# Altium schematic sheet AFE.SchDoc
size Letter; DocumentNumber: 2; SheetNumber: 2; SheetTotal: 5; Website: www.uwmidsun.com
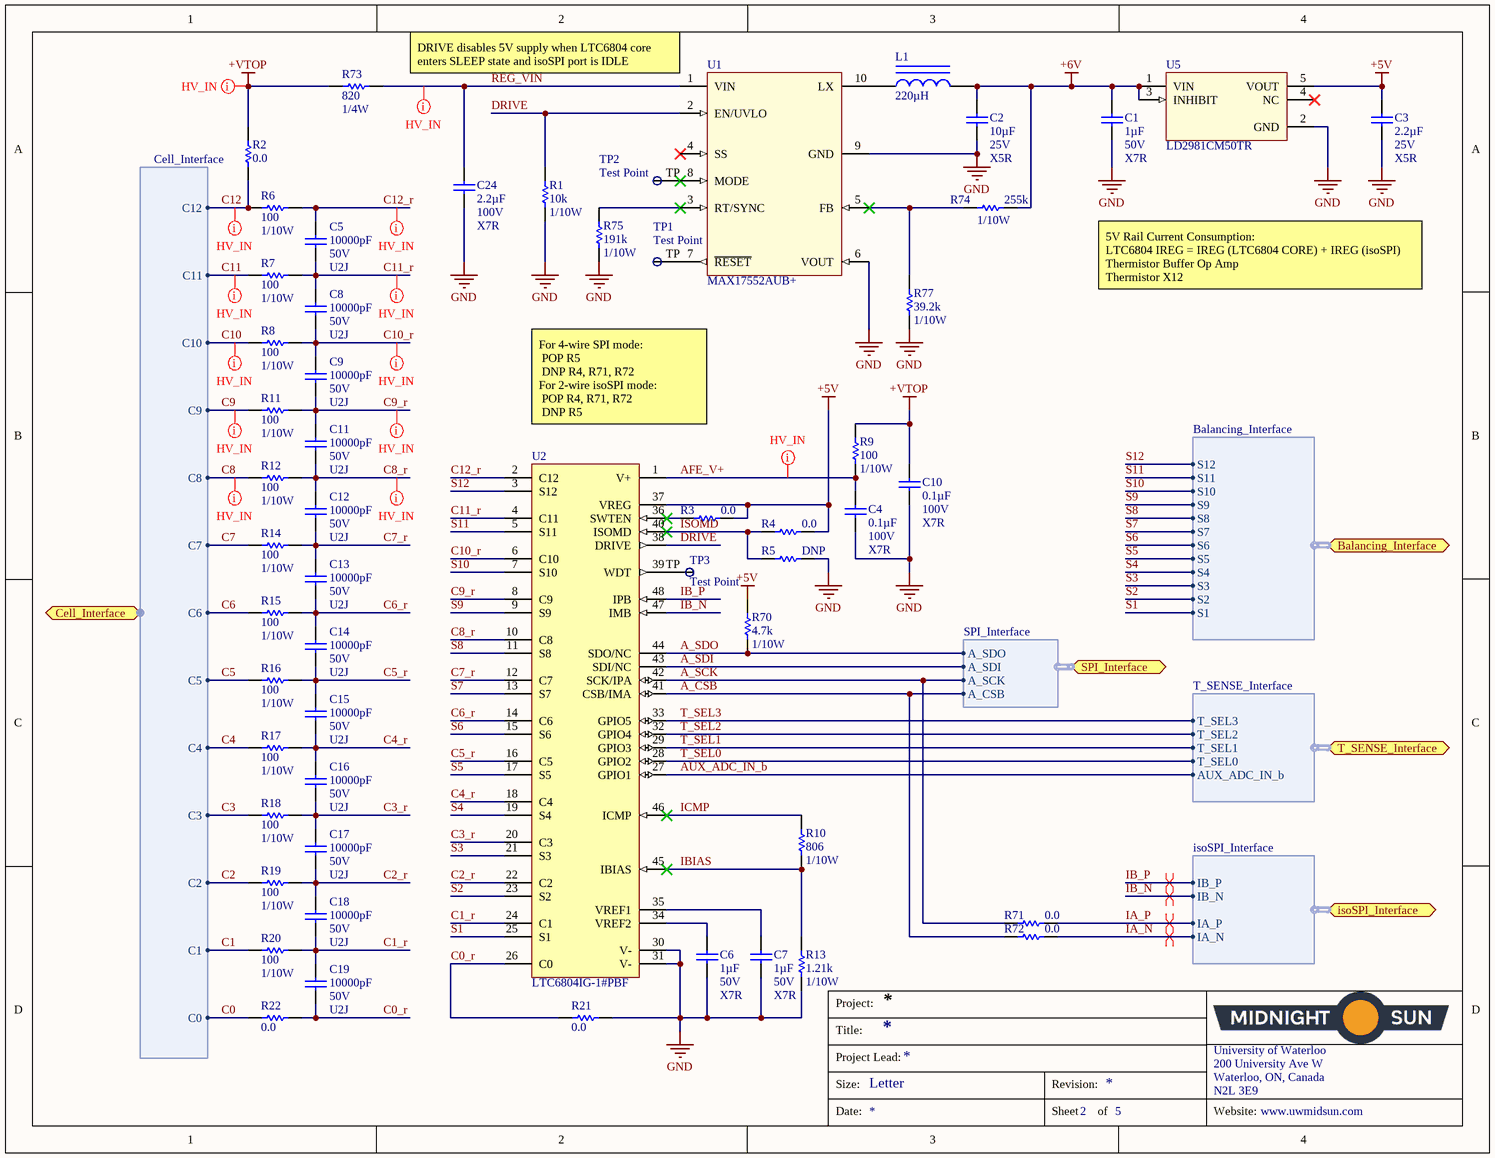
[diagram p0: AFE.SchDoc]

## Parts
C1  Capacitance: 1µF  Voltage: 50V  Temperature Coefficient: X7R  [CAP, 0603]  (hidden comment: CAP CER 1UF 50V 10% X7R 0603)
C2  Capacitance: 10µF  Voltage: 25V  Temperature Coefficient: X5R  [CAP, 0603]  (hidden comment: CAP CER 10uF 25V 20% X5R 0603)
C3  Capacitance: 2.2µF  Voltage: 25V  Temperature Coefficient: X5R  [CAP, 0603]  (hidden comment: CAP CER 2.2UF 25V 10% X5R 0603)
C4  Capacitance: 0.1µF  Voltage: 100V  Temperature Coefficient: X7R  [CAP, 0805]  (hidden comment: CAP CER 0.1UF 100V 10% X7R 0805)
C5  Capacitance: 10000pF  Voltage: 50V  Temperature Coefficient: U2J  [CAP, 0603]  (hidden comment: CAP CER 10nF 50V 5% X7R 0603)
C6  Capacitance: 1µF  Voltage: 50V  Temperature Coefficient: X7R  [CAP, 0603]  (hidden comment: CAP CER 1UF 50V 10% X7R 0603)
C7  Capacitance: 1µF  Voltage: 50V  Temperature Coefficient: X7R  [CAP, 0603]  (hidden comment: CAP CER 1UF 50V 10% X7R 0603)
C8  Capacitance: 10000pF  Voltage: 50V  Temperature Coefficient: U2J  [CAP, 0603]  (hidden comment: CAP CER 10nF 50V 5% X7R 0603)
C9  Capacitance: 10000pF  Voltage: 50V  Temperature Coefficient: U2J  [CAP, 0603]  (hidden comment: CAP CER 10nF 50V 5% X7R 0603)
C10  Capacitance: 0.1µF  Voltage: 100V  Temperature Coefficient: X7R  [CAP, 0805]  (hidden comment: CAP CER 0.1UF 100V 10% X7R 0805)
C11  Capacitance: 10000pF  Voltage: 50V  Temperature Coefficient: U2J  [CAP, 0603]  (hidden comment: CAP CER 10nF 50V 5% X7R 0603)
C12  Capacitance: 10000pF  Voltage: 50V  Temperature Coefficient: U2J  [CAP, 0603]  (hidden comment: CAP CER 10nF 50V 5% X7R 0603)
C13  Capacitance: 10000pF  Voltage: 50V  Temperature Coefficient: U2J  [CAP, 0603]  (hidden comment: CAP CER 10nF 50V 5% X7R 0603)
C14  Capacitance: 10000pF  Voltage: 50V  Temperature Coefficient: U2J  [CAP, 0603]  (hidden comment: CAP CER 10nF 50V 5% X7R 0603)
C15  Capacitance: 10000pF  Voltage: 50V  Temperature Coefficient: U2J  [CAP, 0603]  (hidden comment: CAP CER 10nF 50V 5% X7R 0603)
C16  Capacitance: 10000pF  Voltage: 50V  Temperature Coefficient: U2J  [CAP, 0603]  (hidden comment: CAP CER 10nF 50V 5% X7R 0603)
C17  Capacitance: 10000pF  Voltage: 50V  Temperature Coefficient: U2J  [CAP, 0603]  (hidden comment: CAP CER 10nF 50V 5% X7R 0603)
C18  Capacitance: 10000pF  Voltage: 50V  Temperature Coefficient: U2J  [CAP, 0603]  (hidden comment: CAP CER 10nF 50V 5% X7R 0603)
C19  Capacitance: 10000pF  Voltage: 50V  Temperature Coefficient: U2J  [CAP, 0603]  (hidden comment: CAP CER 10nF 50V 5% X7R 0603)
C24  Capacitance: 2.2µF  Voltage: 100V  Temperature Coefficient: X7R  [CAP, 1206]  (hidden comment: CAP CER 2.2UF 100V ±20% X7R 1206)
L1  Inductance: 220µH  [INDP6060X23N]  (hidden comment: IND 220uH 0.59A 20%)
R1  Resistance: 10k  Power: 1/10W  [RES, 0603]  (hidden comment: RES 10K OHM 1% 1/10W 0603)
R2  Resistance: 0.0  [RES, 0603]  (hidden comment: RES 0.0 OHM 1/4W 0603)
R3  Resistance: 0.0  [RES, 0603]  (hidden comment: RES 0.0 OHM 1/4W 0603)
R4  Resistance: 0.0  [RES, 0603]  (hidden comment: RES 0.0 OHM 1/4W 0603)
R5  Resistance: DNP  [RES, 0603]  (hidden comment: RES 0.0 OHM 1/4W 0603)
R6  Resistance: 100  Power: 1/10W  [RES, 0603]  (hidden comment: RES 100 OHM 1% 1/10W 0603)
R7  Resistance: 100  Power: 1/10W  [RES, 0603]  (hidden comment: RES 100 OHM 1% 1/10W 0603)
R8  Resistance: 100  Power: 1/10W  [RES, 0603]  (hidden comment: RES 100 OHM 1% 1/10W 0603)
R9  Resistance: 100  Power: 1/10W  [RES, 0603]  (hidden comment: RES 100 OHM 1% 1/10W 0603)
R10  Resistance: 806  Power: 1/10W  [RES, 0603]  (hidden comment: RES 806 OHM 1% 1/10W 0603)
R11  Resistance: 100  Power: 1/10W  [RES, 0603]  (hidden comment: RES 100 OHM 1% 1/10W 0603)
R12  Resistance: 100  Power: 1/10W  [RES, 0603]  (hidden comment: RES 100 OHM 1% 1/10W 0603)
R13  Resistance: 1.21k  Power: 1/10W  [RES, 0603]  (hidden comment: RES 1.21K OHM 1% 1/10W 0603)
R14  Resistance: 100  Power: 1/10W  [RES, 0603]  (hidden comment: RES 100 OHM 1% 1/10W 0603)
R15  Resistance: 100  Power: 1/10W  [RES, 0603]  (hidden comment: RES 100 OHM 1% 1/10W 0603)
R16  Resistance: 100  Power: 1/10W  [RES, 0603]  (hidden comment: RES 100 OHM 1% 1/10W 0603)
R17  Resistance: 100  Power: 1/10W  [RES, 0603]  (hidden comment: RES 100 OHM 1% 1/10W 0603)
R18  Resistance: 100  Power: 1/10W  [RES, 0603]  (hidden comment: RES 100 OHM 1% 1/10W 0603)
R19  Resistance: 100  Power: 1/10W  [RES, 0603]  (hidden comment: RES 100 OHM 1% 1/10W 0603)
R20  Resistance: 100  Power: 1/10W  [RES, 0603]  (hidden comment: RES 100 OHM 1% 1/10W 0603)
R21  Resistance: 0.0  [RES, 0603]  (hidden comment: RES 0.0 OHM 1/4W 0603)
R22  Resistance: 0.0  [RES, 0603]  (hidden comment: RES 0.0 OHM 1/4W 0603)
R70  Resistance (Ohms): 4.7k  Power (Watts): 1/10W  [RES, 0603]  (hidden comment: RES 4.7K OHM 1% 1/10W 0603)
R71  Resistance: 0.0  [RES, 0603]  (hidden comment: RES 0.0 OHM 1/4W 0603)
R72  Resistance: 0.0  [RES, 0603]  (hidden comment: RES 0.0 OHM 1/4W 0603)
R73  Resistance: 820  Power: 1/4W  [RES, 0603]  (hidden comment: RES 820 OHM 5% 1/4W 0603)
R74  Resistance (Ohms): 255k  Power (Watts): 1/10W  [RES, 0603]  (hidden comment: RES 255K OHM 1% 1/10W 0603)
R75  Resistance: 191k  Power: 1/10W  [RES, 0603]  (hidden comment: RES 191K OHM 1% 1/10W 0603)
R77  Resistance: 39.2k  Power: 1/10W  [RES, 0603]  (hidden comment: RES 39.2K OHM 1% 1/10W 0603)
TP1  Test Point  [Test Point]
TP2  Test Point  [Test Point]
TP3  Test Point  [Test Point]
U1  Manufacturer Part Number 1: MAX17552AUB+  [TSSOP50P490X110-10N]  (hidden comment: IC REG BUCK ADJ 0.1A 10UMAX)
U2  Manufacturer Part Number 1: LTC6804IG-1#PBF  [SSOP50P780X200-48N]  (hidden comment: IC MONITOR BATT STACK 48SSOP)
U5  Manufacturer Part Number 1: LD2981CM50TR  [SOT95P280X145-5N]  (hidden comment: IC REG LDO 5V 0.1A SOT23-5)

## Ports
Balancing_Interface (harness Balancing_Interface), Cell_Interface (harness Cell_Interface), isoSPI_Interface (harness isoSPI_Interface), SPI_Interface (harness SPI_Interface), T_SENSE_Interface (harness T_SENSE_Interface)

## Harnesses
T_SENSE_Interface: AUX_ADC_IN_b, T_SEL0, T_SEL1, T_SEL2, T_SEL3
isoSPI_Interface: IB_P, IB_N, IA_P, IA_N
Cell_Interface: C12, C11, C10, C9, C8, C7, C6, C5, C4, C3, C2, C1, C0
Balancing_Interface: S12, S11, S10, S9, S8, S7, S6, S5, S4, S3, S2, S1
SPI_Interface: A_SDO, A_SDI, A_SCK, A_CSB

## Nets
+5V: C3.1 R3.1 R4.2 R70.1 U2.37(VREG) U5.5(VOUT)
+6V: C1.1 C2.1 L1.2 R74.2 U5.1(VIN) U5.3(INHIBIT)
+VTOP: C10.1 R2.1 R9.1 R73.1
GND: C1.2 C2.2 C3.2 C4.2 C6.2 C7.2 C10.2 C24.2 R1.2 R5.1 R13.2 R21.2 R75.2 R77.2 U1.6(VOUT) U1.9(GND) U2.30(V-) U2.31(V-) U5.2(GND)
A_CSB: R72.2 U2.41(CSB/IMA) ; port SPI_Interface.A_CSB
A_SCK: R71.2 U2.42(SCK/IPA) ; port SPI_Interface.A_SCK
A_SDI: U2.43(SDI/NC) ; port SPI_Interface.A_SDI
A_SDO: R70.2 U2.44(SDO/NC) ; port SPI_Interface.A_SDO
AFE_V+: C4.1 R9.2 U2.1(V+)
AUX_ADC_IN_b: U2.27(GPIO1) ; port T_SENSE_Interface.AUX_ADC_IN_b
C0: R22.1 ; port Cell_Interface.C0
C0_r: C19.2 R21.1 R22.2 U2.26(C0)
C1: R20.1 ; port Cell_Interface.C1
C1_r: C18.2 C19.1 R20.2 U2.24(C1)
C2: R19.1 ; port Cell_Interface.C2
C2_r: C17.2 C18.1 R19.2 U2.22(C2)
C3: R18.1 ; port Cell_Interface.C3
C3_r: C16.2 C17.1 R18.2 U2.20(C3)
C4: R17.1 ; port Cell_Interface.C4
C4_r: C15.2 C16.1 R17.2 U2.18(C4)
C5: R16.1 ; port Cell_Interface.C5
C5_r: C14.2 C15.1 R16.2 U2.16(C5)
C6: R15.1 ; port Cell_Interface.C6
C6_r: C13.2 C14.1 R15.2 U2.14(C6)
C7: R14.1 ; port Cell_Interface.C7
C7_r: C12.2 C13.1 R14.2 U2.12(C7)
C8: R12.1 ; port Cell_Interface.C8
C8_r: C11.2 C12.1 R12.2 U2.10(C8)
C9: R11.1 ; port Cell_Interface.C9
C9_r: C9.2 C11.1 R11.2 U2.8(C9)
C10: R8.1 ; port Cell_Interface.C10
C10_r: C8.2 C9.1 R8.2 U2.6(C10)
C11: R7.1 ; port Cell_Interface.C11
C11_r: C5.2 C8.1 R7.2 U2.4(C11)
C12: R2.2 R6.1 ; port Cell_Interface.C12
C12_r: C5.1 R6.2 U2.2(C12)
DRIVE: R1.1 U1.2(EN/UVLO) U2.38(DRIVE)
IA_N: R72.1 ; port isoSPI_Interface.IA_N
IA_P: R71.1 ; port isoSPI_Interface.IA_P
IB_N: U2.47(IMB) ; port isoSPI_Interface.IB_N
IB_P: U2.48(IPB) ; port isoSPI_Interface.IB_P
IBIAS: R10.2 R13.1 U2.45(IBIAS)
ICMP: R10.1 U2.46(ICMP)
ISOMD: R4.1 R5.2 U2.40(ISOMD)
REG_VIN: C24.1 R73.2 U1.1(VIN)
S1: U2.25(S1) ; port Balancing_Interface.S1
S2: U2.23(S2) ; port Balancing_Interface.S2
S3: U2.21(S3) ; port Balancing_Interface.S3
S4: U2.19(S4) ; port Balancing_Interface.S4
S5: U2.17(S5) ; port Balancing_Interface.S5
S6: U2.15(S6) ; port Balancing_Interface.S6
S7: U2.13(S7) ; port Balancing_Interface.S7
S8: U2.11(S8) ; port Balancing_Interface.S8
S9: U2.9(S9) ; port Balancing_Interface.S9
S10: U2.7(S10) ; port Balancing_Interface.S10
S11: U2.5(S11) ; port Balancing_Interface.S11
S12: U2.3(S12) ; port Balancing_Interface.S12
T_SEL0: U2.28(GPIO2) ; port T_SENSE_Interface.T_SEL0
T_SEL1: U2.29(GPIO3) ; port T_SENSE_Interface.T_SEL1
T_SEL2: U2.32(GPIO4) ; port T_SENSE_Interface.T_SEL2
T_SEL3: U2.33(GPIO5) ; port T_SENSE_Interface.T_SEL3
NetC6_1: C6.1 U2.34(VREF2)
NetC7_1: C7.1 U2.35(VREF1)
NetL1_1: L1.1 U1.10(LX)
NetR3_2: R3.2 U2.36(SWTEN)
NetR74_1: R74.1 R77.1 U1.5(FB)
NetR75_1: R75.1 U1.3(RT/SYNC)
NetTP1_TP: TP1.TP U1.7(~{RESET})
NetTP2_TP: TP2.TP U1.8(MODE)
NetTP3_TP: TP3.TP U2.39(WDT)

Not connected (* = marked no-connect by the designer): U1 4(SS)*; U5 4(NC)*

## Layout directives
differential pair: IA_N, IA_P, IB_N, IB_P
net class HV_IN: +VTOP, AFE_V+, C8, C8_r, C9, C9_r, C10, C10_r, C11, C11_r, C12, C12_r, REG_VIN

## Notes on the sheet
- DRIVE disables 5V supply when LTC6804 core enters SLEEP state and isoSPI port is IDLE
- 5V Rail Current Consumption:
  LTC6804 IREG = IREG (LTC6804 CORE) + IREG (isoSPI)
  Thermistor Buffer Op Amp
  Thermistor X12
- For 4-wire SPI mode:
  POP R5
  DNP R4, R71, R72
  For 2-wire isoSPI mode:
  POP R4, R71, R72
  DNP R5
- Project:
- Title:
- Size:
- Project Lead:
- Letter
- Revision:
- University of Waterloo
- 200 University Ave W
- Waterloo, ON, Canada
- N2L 3E9
- Date:
- Sheet
- of
- Website:

## Library data of the parts
C1 C6 C7 = CAP CER 1UF 50V 10% X7R 0603: 1µF ±10% 50V Ceramic Capacitor X7R 0603 (1608 Metric); Manufacturer 1: Taiyo Yuden; Manufacturer Part Number 1: UMK107AB7105KA-T; Supplier 1: Digi-Key; Supplier Part Number 1: 587-3247-1-ND; Packaging: Cut Tape (CT); Part Status: Active; Operating Temperature: -55°C ~ 125°C; Ratings: -; Mounting Type: Surface Mount, MLCC; Package / Case: 0603 (1608 Metric); Size / Dimension: 0.063" L x 0.031" W (1.60mm x 0.80mm); Height - Seated (Max): -; Thickness (Max): 0.037" (0.95mm); Lead Spacing: -; Lead Style: -; ComponentLink1URL: http://www.yuden.co.jp/productdata/catalog/en/mlcc_all_e.pdf; ComponentLink1Description: http://www.yuden.co.jp/productdata/catalog/en/mlcc_all_e.pdf; Tolerance: ±10%
C2 = CAP CER 10uF 25V 20% X5R 0603: 10µF ±20% 25V Ceramic Capacitor X5R 0603 (1608 Metric); Manufacturer 1: Murata Electronics North America; Manufacturer Part Number 1: GRM188R61E106MA73D; Supplier 1: Digi-Key; Supplier Part Number 1: 490-7202-1-ND; Packaging: Cut Tape (CT); Part Status: Active; Operating Temperature: -55°C ~ 85°C; Ratings: -; Mounting Type: Surface Mount, MLCC; Package / Case: 0603 (1608 Metric); Size / Dimension: 0.063" L x 0.031" W (1.60mm x 0.80mm); Height - Seated (Max): -; Thickness (Max): 0.031" (0.80mm); Lead Spacing: -; Lead Style: -; ComponentLink1URL: http://www.murata.com/~/media/webrenewal/support/library/catalog/products/capacitor/mlcc/c02e.ashx; ComponentLink1Description: http://www.murata.com/~/media/webrenewal/support/library/catalog/products/capacitor/mlcc/c02e.ashx; Tolerance: ±20%
C3 = CAP CER 2.2UF 25V 10% X5R 0603: 2.2µF ±10% 25V Ceramic Capacitor X5R 0603 (1608 Metric); Manufacturer 1: Murata Electronics North America; Manufacturer Part Number 1: GRM188R61E225KA12D; Supplier 1: Digi-Key; Supplier Part Number 1: 490-10731-1-ND; Packaging: Cut Tape (CT); Part Status: Active; Operating Temperature: -55°C ~ 85°C; Ratings: -; Mounting Type: Surface Mount, MLCC; Package / Case: 0603 (1608 Metric); Size / Dimension: 0.063" L x 0.031" W (1.60mm x 0.80mm); Height - Seated (Max): -; Thickness (Max): 0.035" (0.90mm); Lead Spacing: -; Lead Style: -; ComponentLink1URL: http://www.murata.com/~/media/webrenewal/support/library/catalog/products/capacitor/mlcc/c02e.ashx; ComponentLink1Description: http://www.murata.com/~/media/webrenewal/support/library/catalog/products/capacitor/mlcc/c02e.ashx; Tolerance: ±10%
C4 C10 = CAP CER 0.1UF 100V 10% X7R 0805: 0.1µF ±10% 100V Ceramic Capacitor X7R 0805 (2012 Metric); Manufacturer 1: Murata Electronics North America; Manufacturer Part Number 1: GCM21BR72A104KA37L; Supplier 1: Digi-Key; Supplier Part Number 1: 490-4789-1-ND; Packaging: Cut Tape (CT); Part Status: Active; Operating Temperature: -55°C ~ 125°C; Ratings: AEC-Q200; Mounting Type: Surface Mount, MLCC; Package / Case: 0805 (2012 Metric); Size / Dimension: 0.079" L x 0.049" W (2.00mm x 1.25mm); Height - Seated (Max): -; Thickness (Max): 0.055" (1.40mm); Lead Spacing: -; Lead Style: -; ComponentLink1URL: http://www.murata.com/~/media/webrenewal/support/library/catalog/products/capacitor/mlcc/c03e.ashx; ComponentLink1Description: http://www.murata.com/~/media/webrenewal/support/library/catalog/products/capacitor/mlcc/c03e.ashx; Tolerance: ±10%
C5 C8 C9 C11-C19 = CAP CER 10nF 50V 5% X7R 0603: 10000pF ±5% 50V Ceramic Capacitor U2J 0603 (1608 Metric); Manufacturer 1: KEMET; Manufacturer Part Number 1: C0603C103J5JAC7867; Supplier 1: Digi-Key; Supplier Part Number 1: 399-13384-1-ND; Packaging: Cut Tape (CT); Part Status: Active; Operating Temperature: -55°C ~ 125°C; Ratings: -; Failure Rate: -; Mounting Type: Surface Mount, MLCC; Package / Case: 0603 (1608 Metric); Size / Dimension: 0.063" L x 0.032" W (1.60mm x 0.80mm); Height - Seated (Max): -; Thickness (Max): 0.034" (0.87mm); Lead Spacing: -; Lead Style: -; ComponentLink1URL: http://www.kemet.com/docfinder?Partnumber=C0603C103J5JAC7867; ComponentLink1Description: http://www.kemet.com/docfinder?Partnumber=C0603C103J5JAC7867; Tolerance: ±5%
C24 = CAP CER 2.2UF 100V ±20% X7R 1206: 2.2µF ±20% 100V Ceramic Capacitor X7R 1206 (3216 Metric); Manufacturer 1: Murata Electronics North America; Manufacturer Part Number 1: GRM31CR72A225MA73L; Supplier 1: Digi-Key; Supplier Part Number 1: 490-12773-1-ND; Packaging: Cut Tape (CT); Part Status: Active; Operating Temperature: -55°C ~ 125°C; Ratings: -; Mounting Type: Surface Mount, MLCC; Package / Case: 1206 (3216 Metric); Size / Dimension: 0.126" L x 0.063" W (3.20mm x 1.60mm); Height - Seated (Max): -; Thickness (Max): 0.071" (1.80mm); Lead Spacing: -; Lead Style: -; ComponentLink1URL: http://www.murata.com/~/media/webrenewal/support/library/catalog/products/capacitor/mlcc/c02e.ashx; ComponentLink1Description: http://www.murata.com/~/media/webrenewal/support/library/catalog/products/capacitor/mlcc/c02e.ashx; Tolerance: ±20%
L1 = IND 220uH 0.59A 20%: 220µH Shielded Inductor 590mA 834 mOhm Nonstandard; Manufacturer 1: Laird-Signal Integrity Products; Manufacturer Part Number 1: TYS6045221M-10; Current - Saturation: 700mA; Frequency - Self Resonant: 3.5MHz; Supplier 1: Digi-Key; Supplier Part Number 1: 240-2742-1-ND; Packaging: Cut Tape (CT); Part Status: Active; Type: -; Material - Core: -; Current Rating: 590mA; Shielding: Shielded; DC Resistance (DCR): 834 mOhm; Q @ Freq: -; Ratings: AEC-Q200; Operating Temperature: -40°C ~ 125°C; Mounting Type: Surface Mount; Package / Case: Nonstandard; Supplier Device Package: -; Size / Dimension: 0.236" L x 0.236" W (6.00mm x 6.00mm); Height - Seated (Max): 0.185" (4.70mm); ComponentLink1URL: http://assets.lairdtech.com/home/brandworld/files/TYS6045221M-10.pdf; ComponentLink1Description: http://assets.lairdtech.com/home/brandworld/files/TYS6045221M-10.pdf; Tolerance: ±20%
R1 = RES 10K OHM 1% 1/10W 0603: RES SMD 10K OHM 1% 1/10W 0603; Manufacturer 1: Yageo; Manufacturer Part Number 1: RC0603FR-0710KL; Temperature Coefficient: ±100ppm/°C; Supplier 1: Digi-Key; Supplier Part Number 1: 311-10.0KHRCT-ND; Packaging: Cut Tape (CT); Part Status: Active; Composition: Thick Film; Operating Temperature: -55°C ~ 155°C; Package / Case: 0603 (1608 Metric); Supplier Device Package: 0603; Size / Dimension: 0.063" L x 0.031" W (1.60mm x 0.80mm); Height - Seated (Max): 0.022" (0.55mm); Failure Rate: -; ComponentLink1URL: http://www.yageo.com/documents/recent/PYu-RC_Group_51_RoHS_L_7.pdf; ComponentLink1Description: http://www.yageo.com/documents/recent/PYu-RC_Group_51_RoHS_L_7.pdf; Tolerance: ±1%
R2-R5 R21 R22 R71 R72 = RES 0.0 OHM 1/4W 0603: RES SMD 0.0 OHM JUMPER 1/4W 0603; Manufacturer 1: Vishay Dale; Manufacturer Part Number 1: CRCW06030000Z0EAHP; Supplier 1: Digi-Key; Supplier Part Number 1: 541-0.0SBCT-ND; Packaging: Cut Tape (CT); Part Status: Active; Composition: Thick Film; Operating Temperature: -55°C ~ 155°C; Package / Case: 0603 (1608 Metric); Supplier Device Package: 0603; Size / Dimension: 0.063" L x 0.033" W (1.60mm x 0.85mm); Height - Seated (Max): 0.022" (0.55mm); Failure Rate: -; ComponentLink1URL: http://www.vishay.com/docs/20043/crcwhpe3.pdf; ComponentLink1Description: http://www.vishay.com/docs/20043/crcwhpe3.pdf; Power (Watts): 1/4W
R6-R9 R11 R12 R14-R20 = RES 100 OHM 1% 1/10W 0603: 100 Ohm ±1% 0.1W, 1/10W Chip Resistor 0603 (1608 Metric) Moisture Resistant Thick Film; Manufacturer 1: Yageo; Manufacturer Part Number 1: RC0603FR-07100RL; Temperature Coefficient: ±100ppm/°C; Supplier 1: Digi-Key; Supplier Part Number 1: 311-100HRCT-ND; Packaging: Cut Tape (CT); Part Status: Active; Composition: Thick Film; Operating Temperature: -55°C ~ 155°C; Package / Case: 0603 (1608 Metric); Supplier Device Package: 0603; Size / Dimension: 0.063" L x 0.031" W (1.60mm x 0.80mm); Height - Seated (Max): 0.022" (0.55mm); Failure Rate: -; ComponentLink1URL: http://www.yageo.com/documents/recent/PYu-RC_Group_51_RoHS_L_7.pdf; ComponentLink1Description: http://www.yageo.com/documents/recent/PYu-RC_Group_51_RoHS_L_7.pdf; Tolerance: ±1%
R10 = RES 806 OHM 1% 1/10W 0603: 806 Ohm ±1% 0.1W, 1/10W Chip Resistor 0603 (1608 Metric) Moisture Resistant Thick Film; Manufacturer 1: Yageo; Manufacturer Part Number 1: RC0603FR-07806RL; Temperature Coefficient: ±100ppm/°C; Supplier 1: Digi-Key; Supplier Part Number 1: 311-806HRCT-ND; Packaging: Cut Tape (CT); Part Status: Active; Composition: Thick Film; Operating Temperature: -55°C ~ 155°C; Package / Case: 0603 (1608 Metric); Supplier Device Package: 0603; Size / Dimension: 0.063" L x 0.031" W (1.60mm x 0.80mm); Height - Seated (Max): 0.022" (0.55mm); Failure Rate: -; ComponentLink1URL: http://www.yageo.com/documents/recent/PYu-RC_Group_51_RoHS_L_7.pdf; ComponentLink1Description: http://www.yageo.com/documents/recent/PYu-RC_Group_51_RoHS_L_7.pdf; Tolerance: ±1%
R13 = RES 1.21K OHM 1% 1/10W 0603: 1.21k Ohm ±1% 0.1W, 1/10W Chip Resistor 0603 (1608 Metric) Moisture Resistant Thick Film; Manufacturer 1: Yageo; Manufacturer Part Number 1: RC0603FR-071K21L; Temperature Coefficient: ±100ppm/°C; Supplier 1: Digi-Key; Supplier Part Number 1: 311-1.21KHRCT-ND; Packaging: Cut Tape (CT); Part Status: Active; Composition: Thick Film; Operating Temperature: -55°C ~ 155°C; Package / Case: 0603 (1608 Metric); Supplier Device Package: 0603; Size / Dimension: 0.063" L x 0.031" W (1.60mm x 0.80mm); Height - Seated (Max): 0.022" (0.55mm); Failure Rate: -; ComponentLink1URL: http://www.yageo.com/documents/recent/PYu-RC_Group_51_RoHS_L_7.pdf; ComponentLink1Description: http://www.yageo.com/documents/recent/PYu-RC_Group_51_RoHS_L_7.pdf; Tolerance: ±1%
R70 = RES 4.7K OHM 1% 1/10W 0603: 4.7k Ohm ±1% 0.1W, 1/10W Chip Resistor 0603 (1608 Metric) Moisture Resistant Thick Film; Manufacturer 1: Yageo; Manufacturer Part Number 1: RC0603FR-074K7L; Description 1: RES SMD 4.7K OHM 1% 1/10W 0603; Temperature Coefficient: ±100ppm/°C; Supplier 1: Digi-Key; Supplier Part Number 1: 311-4.70KHRCT-ND; RoHS: RoHS Compliant; Category: Resistors; Stock 1: 3487566; Pricing 1: 1=0.16, 10=0.022, 100=0.0089, 1000=0.00402, 2500=0.00349 (CAD); Packaging: Cut Tape (CT); Part Status: Active; Composition: Thick Film; Features: Moisture Resistant; Operating Temperature: -55°C ~ 155°C; Package / Case: 0603 (1608 Metric); Supplier Device Package: 0603; Size / Dimension: 0.063" L x 0.031" W (1.60mm x 0.80mm); Height - Seated (Max): 0.022" (0.55mm); Failure Rate: -; ComponentLink1URL: http://www.yageo.com/documents/recent/PYu-RC_Group_51_RoHS_L_7.pdf; ComponentLink1Description: http://www.yageo.com/documents/recent/PYu-RC_Group_51_RoHS_L_7.pdf; Tolerance: ±1%
R73 = RES 820 OHM 5% 1/4W 0603: RES SMD 820 OHM 5% 1/4W 0603; Manufacturer 1: Rohm Semiconductor; Manufacturer Part Number 1: ESR03EZPJ821; Temperature Coefficient: ±200ppm/°C; Supplier 1: Digi-Key; Supplier Part Number 1: RHM820DCT-ND; Packaging: Cut Tape (CT); Part Status: Active; Composition: Thick Film; Operating Temperature: -55°C ~ 155°C; Package / Case: 0603 (1608 Metric); Supplier Device Package: 0603; Size / Dimension: 0.063" L x 0.031" W (1.60mm x 0.80mm); Height - Seated (Max): 0.022" (0.55mm); Failure Rate: -; ComponentLink1URL: http://www.rohm.com/web/global/datasheet/ESR01MZPF/esr-e; ComponentLink1Description: http://www.rohm.com/web/global/datasheet/ESR01MZPF/esr-e; Tolerance: ±5%
R74 = RES 255K OHM 1% 1/10W 0603: 255k Ohm ±1% 0.1W, 1/10W Chip Resistor 0603 (1608 Metric) Moisture Resistant Thick Film; Manufacturer 1: Yageo; Manufacturer Part Number 1: RC0603FR-07255KL; Description 1: RES SMD 255K OHM 1% 1/10W 0603; Temperature Coefficient: ±100ppm/°C; Supplier 1: Digi-Key; Supplier Part Number 1: 311-255KHRCT-ND; RoHS: RoHS Compliant; Category: Resistors; Stock 1: 106564; Pricing 1: 1=0.16, 10=0.022, 100=0.0089, 1000=0.00402, 2500=0.00349 (CAD); Packaging: Cut Tape (CT); Part Status: Active; Composition: Thick Film; Features: Moisture Resistant; Operating Temperature: -55°C ~ 155°C; Package / Case: 0603 (1608 Metric); Supplier Device Package: 0603; Size / Dimension: 0.063" L x 0.031" W (1.60mm x 0.80mm); Height - Seated (Max): 0.022" (0.55mm); Failure Rate: -; ComponentLink1URL: http://www.yageo.com/documents/recent/PYu-RC_Group_51_RoHS_L_7.pdf; ComponentLink1Description: http://www.yageo.com/documents/recent/PYu-RC_Group_51_RoHS_L_7.pdf; Tolerance: ±1%
R75 = RES 191K OHM 1% 1/10W 0603: 191k Ohm ±1% 0.1W, 1/10W Chip Resistor 0603 (1608 Metric) Moisture Resistant Thick Film; Manufacturer 1: Yageo; Manufacturer Part Number 1: RC0603FR-07191KL; Temperature Coefficient: ±100ppm/°C; Supplier 1: Digi-Key; Supplier Part Number 1: 311-191KHRCT-ND; Packaging: Cut Tape (CT); Part Status: Active; Composition: Thick Film; Operating Temperature: -55°C ~ 155°C; Package / Case: 0603 (1608 Metric); Supplier Device Package: 0603; Size / Dimension: 0.063" L x 0.031" W (1.60mm x 0.80mm); Height - Seated (Max): 0.022" (0.55mm); Failure Rate: -; ComponentLink1URL: http://www.yageo.com/documents/recent/PYu-RC_Group_51_RoHS_L_7.pdf; ComponentLink1Description: http://www.yageo.com/documents/recent/PYu-RC_Group_51_RoHS_L_7.pdf; Tolerance: ±1%
R77 = RES 39.2K OHM 1% 1/10W 0603: 39.2k Ohm ±1% 0.1W, 1/10W Chip Resistor 0603 (1608 Metric) Moisture Resistant Thick Film; Manufacturer 1: Yageo; Manufacturer Part Number 1: RC0603FR-0739K2L; Temperature Coefficient: ±100ppm/°C; Supplier 1: Digi-Key; Supplier Part Number 1: 311-39.2KHRCT-ND; Packaging: Cut Tape (CT); Part Status: Active; Composition: Thick Film; Operating Temperature: -55°C ~ 155°C; Package / Case: 0603 (1608 Metric); Supplier Device Package: 0603; Size / Dimension: 0.063" L x 0.031" W (1.60mm x 0.80mm); Height - Seated (Max): 0.022" (0.55mm); Failure Rate: -; ComponentLink1URL: http://www.yageo.com/documents/recent/PYu-RC_Group_51_RoHS_L_7.pdf; ComponentLink1Description: http://www.yageo.com/documents/recent/PYu-RC_Group_51_RoHS_L_7.pdf; Tolerance: ±1%
U1 = IC REG BUCK ADJ 0.1A 10UMAX: Buck Switching Regulator IC Positive Adjustable 0.8V 1 Output 100mA 10-TFSOP, 10-MSOP (0.118", 3.00mm Width); Manufacturer 1: Maxim Integrated; Function: Step-Down; Number of Outputs: 1; Voltage - Input (Min): 4V; Voltage - Input (Max): 60V; Voltage - Output (Max): 54V; Frequency - Switching: 100kHz ~ 2.2MHz; Synchronous Rectifier: Yes; Supplier 1: Digi-Key; Supplier Part Number 1: MAX17552AUB+-ND; Packaging: Tube; Part Status: Active; Output Configuration: Positive; Topology: Buck; Output Type: Adjustable; Voltage - Output (Min/Fixed): 0.8V; Current - Output: 100mA; Operating Temperature: -40°C ~ 125°C (TJ); Mounting Type: Surface Mount; Package / Case: 10-TFSOP, 10-MSOP (0.118", 3.00mm Width); Supplier Device Package: 10-uMAX; ComponentLink1URL: http://datasheets.maximintegrated.com/en/ds/MAX17552.pdf; ComponentLink1Description: http://datasheets.maximintegrated.com/en/ds/MAX17552.pdf
U2 = IC MONITOR BATT STACK 48SSOP: Battery Battery Monitor IC Multi-Chemistry 48-SSOP; Manufacturer 1: Linear Technology; Number of Cells: 1 ~ 12; Fault Protection: Over/Under Voltage; Interface: I²C, SPI; Supplier 1: Digi-Key; Supplier Part Number 1: LTC6804IG-1#PBF-ND; Packaging: Tube; Part Status: Active; Function: Battery Monitor; Battery Chemistry: Multi-Chemistry; Operating Temperature: -40°C ~ 85°C (TA); Package / Case: 48-FSOP (0.209", 5.30mm Width); Supplier Device Package: 48-SSOP; ComponentLink1URL: http://www.linear.com/docs/43171; ComponentLink1Description: http://www.linear.com/docs/43171
U5 = IC REG LDO 5V 0.1A SOT23-5: Linear Voltage Regulator IC Positive Fixed Output 5V 100mA SOT-23-5; Manufacturer 1: STMicroelectronics; Voltage - Dropout (Typical): 0.18V @ 100mA; Voltage - Input: Up to 16V; Supplier 1: Digi-Key; Supplier Part Number 1: 497-7787-1-ND; Packaging: Cut Tape (CT); Part Status: Active; Regulator Topology: Positive Fixed; Voltage - Output: 5V; Current - Output: 100mA; Current - Limit (Min): -; Operating Temperature: -40°C ~ 125°C; Mounting Type: Surface Mount; Package / Case: SC-74A, SOT-753; Supplier Device Package: SOT-23-5; ComponentLink1URL: http://www.st.com/content/ccc/resource/technical/document/datasheet/group1/b7/b5/a1/83/9c/bd/4a/90/CD00001635/files/CD00001635.pdf/jcr:content/translations/en.CD00001635.pdf; ComponentLink1Description: http://www.st.com/content/ccc/resource/technical/document/datasheet/group1/b7/b5/a1/83/9c/bd/4a/90/CD00001635/files/CD00001635.pdf/jcr:content/translations/en.CD00001635.pdf